# EasyEDA Pro project shangchi.eprj

# Schematic Schematic1
Board Name: Board1; Create Date: 2025-05-25; Page Name: 电源和主控; Project Name: shangchi; Schematic Name: Schematic1; Update Date: 2025-07-31; Company: 嘉立创EDA; Page Size: A4; Version: V1.0
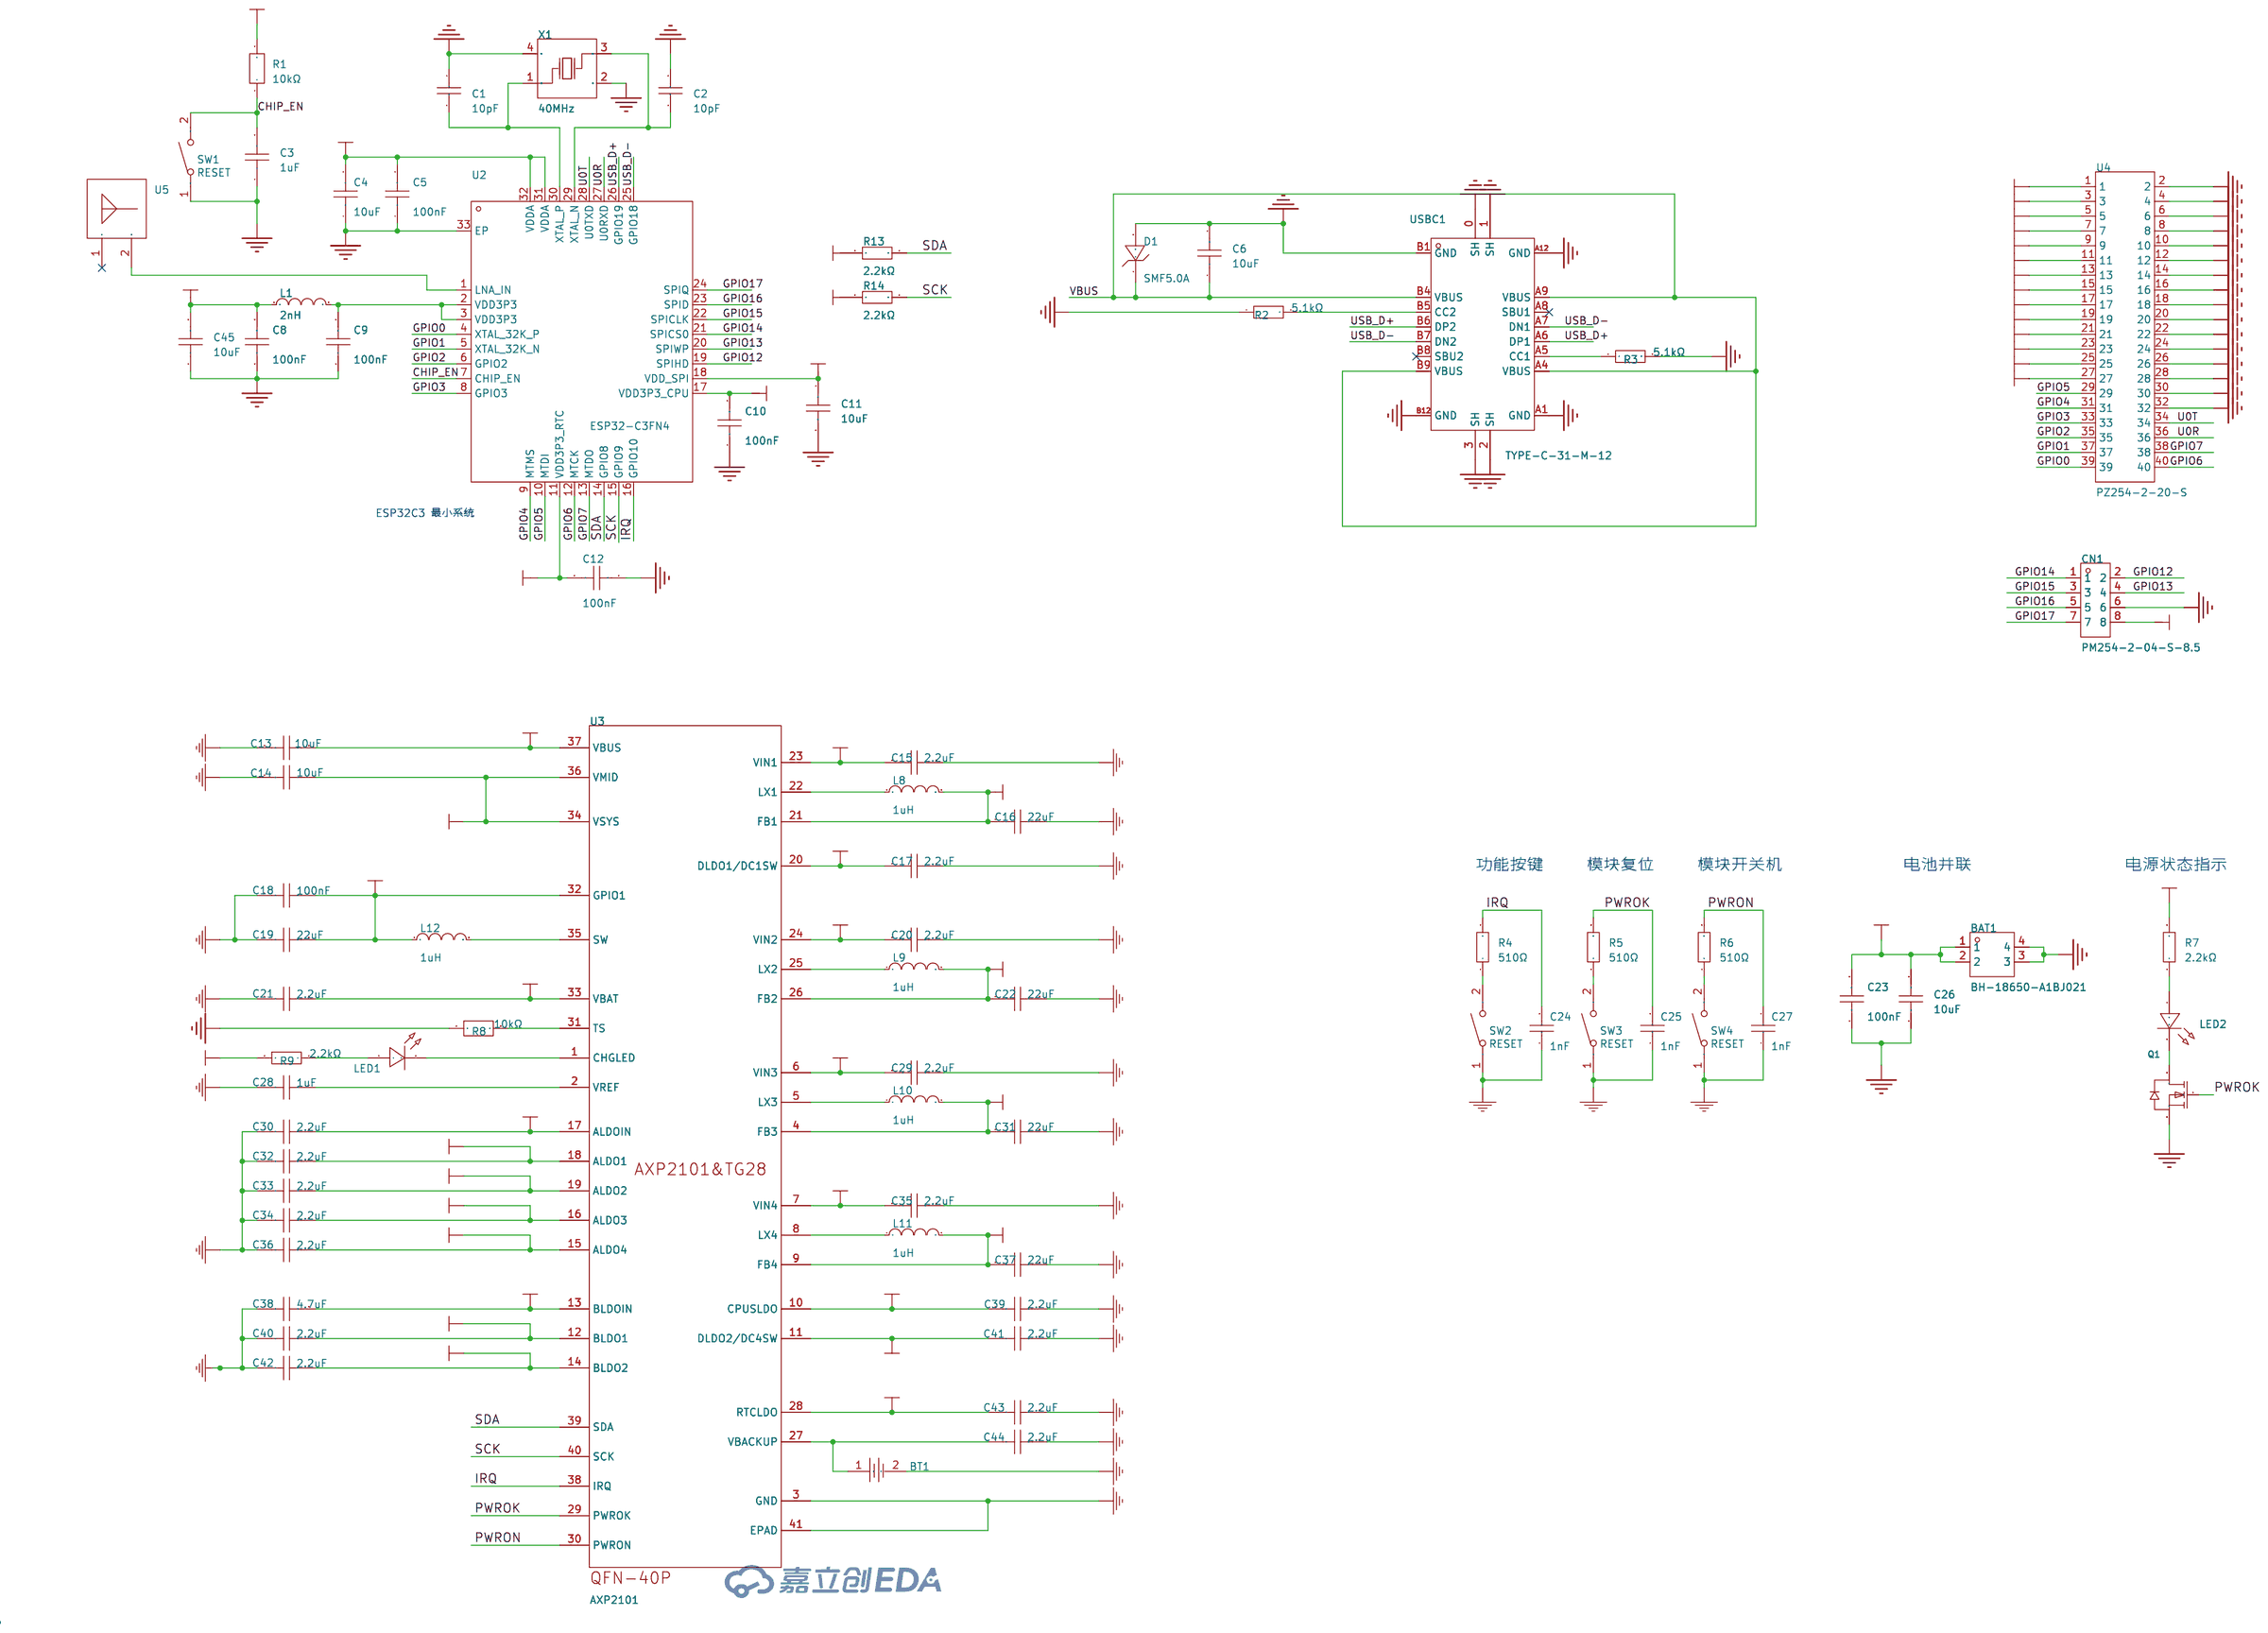
[diagram p0: schematic sheet]

## Parts
BAT1  BH-18650-A1BJ021  [BAT-TH_L77.0-W39.9_BH-18650-A1BJ021]
BT1  CR1220-2ZX  [BAT-SMD_CR1220-2ZX]
C1  10pF  [C0603]
C2  10pF  [C0603]
C3  1uF  [C0603]
C4  10uF  [C0603]
C5  100nF  [C0603]
C6  10uF  [C0603]
C8  100nF  [C0603]
C9  100nF  [C0603]
C10  100nF  [C0603]
C11  10uF  [C0603]
C12  100nF  [C0603]
C13  10uF  [C0603]
C14  10uF  [C0603]
C15  2.2uF  [C0603]
C16  22uF  [C0603]
C17  2.2uF  [C0603]
C18  100nF  [C0603]
C19  22uF  [C0603]
C20  2.2uF  [C0603]
C21  2.2uF  [C0603]
C22  22uF  [C0603]
C23  100nF  [C0603]
C24  1nF  [C0603]
C25  1nF  [C0603]
C26  10uF  [C0603]
C27  1nF  [C0603]
C28  1uF  [C0603]
C29  2.2uF  [C0603]
C30  2.2uF  [C0603]
C31  22uF  [C0603]
C32  2.2uF  [C0603]
C33  2.2uF  [C0603]
C34  2.2uF  [C0603]
C35  2.2uF  [C0603]
C36  2.2uF  [C0603]
C37  22uF  [C0603]
C38  4.7uF  [C0603]
C39  2.2uF  [C0603]
C40  2.2uF  [C0603]
C41  2.2uF  [C0603]
C42  2.2uF  [C0603]
C43  2.2uF  [C0603]
C44  2.2uF  [C0603]
C45  10uF  [C0603]
CN1  PM254-2-04-S-8.5  [HDR-SMD_8P-P2.54-V-F-R2-C4-S7.1]
D1  SMF5.0A  [SOD-123F_L2.8-W1.8-LS3.7-RD]
L1  2nH  [L0603]
L8  1uH  [L0806]
L9  1uH  [L0806]
L10  1uH  [L0806]
L11  1uH  [L0806]
L12  1uH  [L0806]
LED1  SZYY0603R  [LED0603-R-RD]
LED2  SZYY0603R  [LED0603-R-RD]
Q1  AO3400-HXY  [SOT-23_L2.9-W1.3-P1.90-LS2.4-BR]
R1  10kΩ  [R0603]
R2  5.1kΩ  [R0603]
R3  5.1kΩ  [R0603]
R4  510Ω  [R0603]
R5  510Ω  [R0603]
R6  510Ω  [R0603]
R7  2.2kΩ  [R0603]
R8  10kΩ  [R0603]
R9  2.2kΩ  [R0603]
R13  2.2kΩ  [R0603]
R14  2.2kΩ  [R0603]
SW1  RESET  [SW-SMD_L4.0-W2.9-LS5.0]
SW2  RESET  [SW-SMD_L4.0-W2.9-LS5.0]
SW3  RESET  [SW-SMD_L4.0-W2.9-LS5.0]
SW4  RESET  [SW-SMD_L4.0-W2.9-LS5.0]
U2  ESP32-C3FN4  [QFN-32_L5.0-W5.0-P0.50-BL-EP3.7]
U3  AXP2101  [QFN-40_L5.0-W5.0-P0.40-TL-EP3.4]
U4  PZ254-2-20-S  [HDR-SMD_40P-P2.54-V-M-R2-C20-S7.4]
U5  ADWH002  [ANT-SMD_L5.0-W2.0_HM5B]
USBC1  TYPE-C-31-M-12  [USB-C_SMD-TYPE-C-31-M-12]
X1  40MHz  [OSC-SMD_4P-L3.2-W2.5-BL_SIT8008BI]

## Library data of the parts
BAT1 = BH-18650-A1BJ021: LCSC Part Name: 电池盒; Supplier Part: C20606804; Manufacturer: MYOUNG(美阳); Supplier Footprint: 插件; JLCPCB Part Class: 扩展库; Datasheet: https://atta.szlcsc.com/upload/public/pdf/source/20240112/147D77B47FAFC966051AFF7CD950677D.pdf; Supplier: LCSC; Connector Type: 电池盒; Contact Plating: 镍; Operating Temperature Range: -25℃~+85℃
BT1 = CR1220-2ZX: Supplier Part: C969906; Manufacturer: Q&J; Supplier Footprint: SMD; JLCPCB Part Class: Extended Part; Datasheet: https://atta.szlcsc.com/upload/public/pdf/source/20210107/C969906_C1D85B5C66CBBA4D1AEB8467FE1CEC7A.pdf; Supplier: LCSC; Connector Type: 电池底座; Battery Type: CR1220; Operating Temperature Range: -25℃~+85℃
C1 C2 = CL10C100JB8NNNC: LCSC Part Name: 10pF ±5% 50V; Supplier Part: C1634; Manufacturer: SAMSUNG(三星); Supplier Footprint: 0603; JLCPCB Part Class: 基础库; Datasheet: https://atta.szlcsc.com/upload/public/pdf/source/20160218/1457707763339.pdf; Supplier: LCSC; Tolerance: ±5%; Voltage Rated: 50V; Temperature Coefficient: C0G
C3 C28 = CL10A105KO8NNNC: 容值:1uF;精度:±10%;额定电压:16V;材质(温度系数):X5R;; LCSC Part Name: 1uF ±10% 16V; Supplier Part: C1592; Manufacturer: SAMSUNG(三星); Supplier Footprint: 0603; JLCPCB Part Class: Extended Part; Datasheet: https://atta.szlcsc.com/upload/public/pdf/source/20220919/9FBE606BE0D9532D730F292EB26DC5BB.pdf; Supplier: LCSC; Tolerance: ±10%; Voltage Rated: 16V; Temperature Coefficient: X5R
C4 C6 C11 C13 C14 C26 C45 = CL10A106KP8NNNC: 容值:10uF;精度:±10%;额定电压:10V;材质(温度系数):X5R;; LCSC Part Name: 10uF ±10% 10V; Supplier Part: C19702; Manufacturer: SAMSUNG(三星); Supplier Footprint: 0603; JLCPCB Part Class: Basic Part; Datasheet: https://atta.szlcsc.com/upload/public/pdf/source/20160218/1457707763339.pdf; Supplier: LCSC; Tolerance: ±10%; Voltage Rated: 10V; Temperature Coefficient: X5R
C5 C8-C10 C12 C18 C23 = CL10B104KB8NNNC: 容值:100nF;精度:±10%;额定电压:50V;材质(温度系数):X7R;; LCSC Part Name: 100nF ±10% 50V; Supplier Part: C1591; Manufacturer: SAMSUNG(三星); Supplier Footprint: 0603; JLCPCB Part Class: Extended Part; Datasheet: https://atta.szlcsc.com/upload/public/pdf/source/20160218/1457707763339.pdf; Supplier: LCSC; Tolerance: ±10%; Voltage Rated: 50V; Temperature Coefficient: X7R
C15 C17 C20 C21 C29 C30 C32-C36 C39-C44 = CL10A225KP8NNNC: 容值:2.2uF;精度:±10%;额定电压:10V;材质(温度系数):X5R;; LCSC Part Name: 2.2uF ±10% 10V; Supplier Part: C1607; Manufacturer: SAMSUNG(三星); Supplier Footprint: 0603; JLCPCB Part Class: Extended Part; Datasheet: https://atta.szlcsc.com/upload/public/pdf/source/20160218/1457707763339.pdf; Supplier: LCSC; Tolerance: ±10%; Voltage Rated: 10V; Temperature Coefficient: X5R
C16 C19 C22 C31 C37 = CL10A226MQ8NRNC: 容值:22uF;精度:±20%;额定电压:6.3V;材质(温度系数):X5R;; LCSC Part Name: 22uF ±20% 6.3V; Supplier Part: C59461; Manufacturer: SAMSUNG(三星); Supplier Footprint: 0603; JLCPCB Part Class: Basic Part; Datasheet: https://atta.szlcsc.com/upload/public/pdf/source/20160218/1457707763339.pdf; Supplier: LCSC; Tolerance: ±20%; Voltage Rated: 6.3V; Temperature Coefficient: X5R
C24 C25 C27 = CL10B102KB8NNNC: LCSC Part Name: 1nF ±10% 50V; Supplier Part: C1588; Manufacturer: SAMSUNG(三星); Supplier Footprint: 0603; JLCPCB Part Class: 基础库; Datasheet: https://atta.szlcsc.com/upload/public/pdf/source/20160218/1457707763339.pdf; Supplier: LCSC; Tolerance: ±10%; Voltage Rated: 50V; Temperature Coefficient: X7R
C38 = CL10A475KP8NNNC: 容值:4.7uF;精度:±10%;额定电压:10V;材质(温度系数):X5R;; LCSC Part Name: 4.7uF ±10% 10V; Supplier Part: C1705; Manufacturer: SAMSUNG(三星); Supplier Footprint: 0603; JLCPCB Part Class: Extended Part; Datasheet: https://atta.szlcsc.com/upload/public/pdf/source/20160218/1457707763339.pdf; Supplier: LCSC; Tolerance: ±10%; Voltage Rated: 10V; Temperature Coefficient: X5R
CN1 = PM254-2-04-S-8.5: LCSC Part Name: 2x4P 间距:2.54mm 立贴; Supplier Part: C3975149; Manufacturer: HCTL(华灿天禄); Supplier Footprint: SMD,P=2.54mm; JLCPCB Part Class: 扩展库; Datasheet: https://atta.szlcsc.com/upload/public/pdf/source/20230609/7C6F8D8E301C6BBC8F19D55951C36597.pdf; Supplier: LCSC; Holes Structure: 2x4P; Pitch: 2.54mm; Row Spacing: 2.54mm; Circular Hole / Square Hole: 方孔; Mounting Type: 立贴; Number of Rows: 双排; Number of Holes: 8P; Current Rating (Max): 3A; Holes Direction: 顶部; Insulation Height: 8.5mm; Contact Material: 铜合金; Operating Temperature Range: -40℃~+105℃; Soldering Temperature(Max): 260℃@5S
D1 = SMF5.0A_C151296: Supplier Part: C151296; Manufacturer: Littelfuse(美国力特); Supplier Footprint: SOD-123; JLCPCB Part Class: 扩展库; Datasheet: https://atta.szlcsc.com/upload/public/pdf/source/20171201/C151298_15121179413071156555.pdf; Supplier: LCSC; Reverse Stand-Off Voltage (Vrwm): 5V; Maximum Clamping Voltage: 9.2V; Peak Pulse Current (Ipp)@10/1000us: 21.7A; Peak Pulse Power Dissipation (Ppp)@10/1000us: 200W; Breakdown Voltage: 6.4V; Type: TVS
L1 = L_0402: Supplier Footprint: L0402
L8-L12 = HEI201610K-1R0M-Q8DG: LCSC Part Name: 1uH ±20%; Supplier Part: C329576; Manufacturer: Chilisin(奇力新); Supplier Footprint: 0806; JLCPCB Part Class: 扩展库; Datasheet: https://atta.szlcsc.com/upload/public/pdf/source/20190910/C329576_D50CD53D5578B4F4024C555ED7112D00.pdf; Supplier: LCSC; Tolerance: ±20%; Current Rating: 3.1A; DC Resistance(DCR): 50mΩ
LED1 LED2 = SZYY0603R: LCSC Part Name: 红灯; Supplier Part: C434419; Manufacturer: yongyu(永裕光电); Supplier Footprint: 0603; JLCPCB Part Class: Extended Part; Datasheet: https://atta.szlcsc.com/upload/public/pdf/source/20191204/C434419_0B955C1F73FF88449D9A795B6FF49070.pdf; Supplier: LCSC; Emitted Color: 红色; Power Dissipation: 40mW; Forward Current: 20mA; Dominant Wavelength: 615nm~630nm; Peak Wavelength: 645nm; Lens Color: 无色透明透镜; Viewing Angle: 120°; Operating Temperature: -40℃~+85℃
Q1 = AO3400-HXY: 类型:N沟道;漏源电压(Vdss):30V;连续漏极电流(Id):5.8A;功率(Pd):1.4W;导通电阻(RDS(on)@Vgs,Id):28mΩ@10V,5.8A;; LCSC Part Name: N沟道 30V 5.8A; Supplier Part: C4748804; Manufacturer: HXY MOSFET(华轩阳电子); Supplier Footprint: SOT-23; Datasheet: https://atta.szlcsc.com/upload/public/pdf/source/20221216/C6CAAE960F4F5F0616BD2E5413E1C3AD.pdf; Supplier: LCSC; Type: N沟道; Drain Source Voltage (Vdss): 30V; Continuous Drain Current (Id): 5.8A; Power Dissipation (Pd): 1.4W; Drain Source On Resistance (RDS(on)@Vgs,Id): 28mΩ@10V,5.8A; Gate Threshold Voltage (Vgs(th)@Id): 1.4V@250uA; Input Capacitance (Ciss@Vds): 825pF@15V
R1 R8 = RC1608F103CS: LCSC Part Name: 厚膜电阻 10kΩ ±1% 100mW; Supplier Part: C17441167; Manufacturer: SAMSUNG(三星); Supplier Footprint: 0603; JLCPCB Part Class: 扩展库; Datasheet: https://atta.szlcsc.com/upload/public/pdf/source/20210602/455D0E07AED06E76D0C921B8CB06E528.pdf; Supplier: LCSC; Type: 厚膜电阻; Tolerance: ±1%; Power(Watts): 100mW; Temperature Coefficient: ±100ppm/℃; Operating Temperature Range: -55℃~+155℃
R2 R3 = 0603WAF5101T5E: LCSC Part Name: 5.1kΩ ±1% 100mW 厚膜电阻; Supplier Part: C23186; Manufacturer: UNI-ROYAL(厚声); Supplier Footprint: 0603; JLCPCB Part Class: 基础库; Datasheet: https://atta.szlcsc.com/upload/public/pdf/source/20200306/C422600_1E6D84923E4A46A82E41ADD87F860B5C.pdf; Supplier: LCSC; Type: 厚膜电阻; Tolerance: ±1%; Power(Watts): 100mW; Overload Voltage (Max): 75V; Temperature Coefficient: ±100ppm/℃; Operating Temperature Range: -55℃~+155℃
R4-R6 = 0603WAF5100T5E: LCSC Part Name: 510Ω ±1% 100mW 厚膜电阻; Supplier Part: C23193; Manufacturer: UNI-ROYAL(厚声); Supplier Footprint: 0603; JLCPCB Part Class: 基础库; Datasheet: https://atta.szlcsc.com/upload/public/pdf/source/20200306/C422600_1E6D84923E4A46A82E41ADD87F860B5C.pdf; Supplier: LCSC; Type: 厚膜电阻; Tolerance: ±1%; Power(Watts): 100mW; Overload Voltage (Max): 75V; Temperature Coefficient: ±100ppm/℃; Operating Temperature Range: -55℃~+155℃
R7 R9 R13 R14 = 0603WAF2201T5E: LCSC Part Name: 2.2kΩ ±1% 100mW 厚膜电阻; Supplier Part: C4190; Manufacturer: UNI-ROYAL(厚声); Supplier Footprint: 0603; JLCPCB Part Class: 基础库; Datasheet: https://atta.szlcsc.com/upload/public/pdf/source/20200306/C422600_1E6D84923E4A46A82E41ADD87F860B5C.pdf; Supplier: LCSC; Type: 厚膜电阻; Tolerance: ±1%; Power(Watts): 100mW; Overload Voltage (Max): 75V; Temperature Coefficient: ±100ppm/℃; Operating Temperature Range: -55℃~+155℃
SW1-SW4 = RESET: Supplier: LCSC; Supplier Part: C318893; Manufacturer: XKB Enterprise; Manufacturer Part: TS-1185EC-C-D-B; JLCPCB Part Class: Extended Part
U2 = ESP32-C3FN4: LCSC Part Name: 搭载 RISC-V 32 位单核处理器的极低功耗 SoC; Supplier Part: C2848860; Manufacturer: ESPRESSIF(乐鑫); Supplier Footprint: QFN-32-EP(5x5); JLCPCB Part Class: 扩展库; Datasheet: https://atta.szlcsc.com/upload/public/pdf/source/20240822/B2742F38BA1EE0E2910459276C4BCB53.pdf; Supplier: LCSC
U3 = AXP2101: A PMU designed by Allwinner; Supplier Part: C3036461; Manufacturer: x-powers; Supplier Footprint: QFN-40-EP(5x5); JLCPCB Part Class: Extended Part; Datasheet: https://atta.szlcsc.com/upload/public/pdf/source/20230506/27D868F447993329A9E953603DF31964.pdf; Supplier: LCSC
U4 = PZ254-2-20-S: LCSC Part Name: 黑色 2x20P 间距:2.54mm 方针 立贴; Supplier Part: C3294478; Manufacturer: HCTL(华灿天禄); Supplier Footprint: SMD,P=2.54mm; JLCPCB Part Class: 扩展库; Datasheet: https://atta.szlcsc.com/upload/public/pdf/source/20230609/FB2B5B924AA338E6CB93C3BD1D012B72.pdf; Supplier: LCSC; Pin Structure: 2x20P; Pitch: 2.54mm; Row Spacing: 2.54mm; Circluar Pins/Square Pins: 方针; Mounting Type: 立贴; Number of Rows: 双排; Number of Pins: 40P; Current Rating: 3A; Voltage Rating (Max): 250V; Length of Mating Pin: 6mm; Insulation Height: 2.5mm; Operating Temperature: -40℃~+105℃; Color: 黑色
U5 = ADWH002: LCSC Part Name: 2.4GHz SMD贴片天线 蓝牙/WiFi/zigbee芯片天线 大款; Supplier Part: C22467691; Manufacturer: MyAntenna(摩天射频); Supplier Footprint: SMD; JLCPCB Part Class: 扩展库; Datasheet: https://atta.szlcsc.com/upload/public/pdf/source/20240625/D215ED83B6453DB4ED1D0491E177A9EC.pdf; Supplier: LCSC; Frequency(Center/Band): 2.45GHz; Bandwidth: 100MHz; Peak Gain: 0.67dBi; Impedance: 50Ω; Power: 3W; VSWR: 2; Operating Temperature: -40℃~+85℃
USBC1 = TYPE-C-31-M-12: LCSC Part Name: Type-C 母; Supplier Part: C165948; Manufacturer: 韩国韩荣; Supplier Footprint: SMD; JLCPCB Part Class: Extended Part; Datasheet: https://atta.szlcsc.com/upload/public/pdf/source/20220525/466408E853115E789EDB0DDC29077C05.pdf; Supplier: LCSC; Connector Type: Type-C; Gender: 母; Number of Contacts: 16P; Number of Ports: 1; Current Rating - Power (Max): 5A
X1 = X322540MPB4SI: 频率:40MHz;频率公差:±10ppm;负载电容:15pF;; LCSC Part Name: 40MHz ±10ppm 15pF YSX321SL; Supplier Part: C9010; Manufacturer: YXC(扬兴晶振); Supplier Footprint: SMD3225-4P; JLCPCB Part Class: 扩展库; Datasheet: https://atta.szlcsc.com/upload/public/pdf/source/20210329/C112971_1F611BDC486E193C1706F6D8EB5AA189.pdf; Supplier: LCSC; Crystal Type: 贴片无源晶振; Frequency Tolerance: ±10ppm; Frequency Stability: ±30ppm; Load Capacitance: 15pF; Operating Temperature: -40℃~+85℃

## Nets
3V3: C4.2 C5.2 C8.2 C10.2 C11.1 C12.2 C16.1 C45.2 CN1.8 L1.1 L8.2 R1.2 R13.2 R14.2 U2.11(VDD3P3_RTC) U2.17(VDD3P3_CPU) U2.18(VDD_SPI) U2.31(VDDA) U2.32(VDDA) U3.21(FB1)
GND: BAT1.3 BAT1.4 BT1.2 C1.2 C2.2 C3.1 C4.1 C5.1 C6.2 C8.1 C9.1 C10.1 C11.2 C12.1 C13.1 C14.2 C15.2 C16.2 C17.2 C18.1 C19.1 C20.2 C21.1 C22.2 C23.1 C24.1 C25.1 C26.1 C27.1 C28.1 C29.2 C30.1 C31.2 C32.1 C33.1 C34.1 C35.2 C36.1 C37.2 C38.1 C39.2 C40.1 C41.2 C42.1 C43.2 C44.2 C45.1 CN1.6 D1.2 Q1.2(S) R2.1 R3.2 R8.1 SW1.1 SW2.1 SW3.1 SW4.1 U2.33(EP) U3.3(GND) U3.41(EPAD) U4.2 U4.4 U4.6 U4.8 U4.10 U4.12 U4.14 U4.16 U4.18 U4.20 U4.22 U4.24 U4.26 U4.28 U4.30 U4.32 USBC1.0(SH) USBC1.1(SH) USBC1.2(SH) USBC1.3(SH) USBC1.A1(GND) USBC1.A12(GND) USBC1.B1(GND) USBC1.B12(GND) X1.2(GND) X1.4(GND)
VBAT: BAT1.1 BAT1.2 C21.2 C23.2 C26.2 U3.33(VBAT)
VBUS: C6.1 C13.2 D1.1 U3.37(VBUS) USBC1.A4(VBUS) USBC1.A9(VBUS) USBC1.B4(VBUS) USBC1.B9(VBUS)
ALDO1: C32.2 U3.18(ALDO1) U4.13
ALDO2: C33.2 U3.19(ALDO2) U4.11
ALDO3: C34.2 U3.16(ALDO3) U4.15
ALDO4: C36.2 U3.15(ALDO4) U4.17
BLDO1: C40.2 U3.12(BLDO1) U4.21
BLDO2: C42.2 U3.14(BLDO2) U4.19
CHIP_EN: C3.2 R1.1 SW1.2 U2.7(CHIP_EN)
CPUS_LDO: C39.1 U3.10(CPUSLDO) U4.25
DC1SW: C17.1 U3.20(DLDO1/DC1SW) U4.9
DC4SW: C41.1 U3.11(DLDO2/DC4SW) U4.23
DCDC2: C22.1 L9.2 U3.26(FB2) U4.7
DCDC3: C31.1 L10.2 U3.4(FB3) U4.1
DCDC4: C37.1 L11.2 U3.9(FB4) U4.27
DCDC5: C18.2 C19.2 L12.1 U3.32(GPIO1) U4.3
GPIO0: U2.4(XTAL_32K_P) U4.39
GPIO1: U2.5(XTAL_32K_N) U4.37
GPIO2: U2.6(GPIO2) U4.35
GPIO3: U2.8(GPIO3) U4.33
GPIO4: U2.9(MTMS) U4.31
GPIO5: U2.10(MTDI) U4.29
GPIO6: U2.12(MTCK) U4.40
GPIO7: U2.13(MTDO) U4.38
GPIO12: CN1.2 U2.19(SPIHD)
GPIO13: CN1.4 U2.20(SPIWP)
GPIO14: CN1.1 U2.21(SPICS0)
GPIO15: CN1.3 U2.22(SPICLK)
GPIO16: CN1.5 U2.23(SPID)
GPIO17: CN1.7 U2.24(SPIQ)
IRQ: C24.2 R4.2 U2.16(GPIO10) U3.38(IRQ)
PWROK: C25.2 Q1.1(G) R5.2 U3.29(PWROK)
PWRON: C27.2 R6.2 U3.30(PWRON)
RTC_LDO: C43.1 U3.28(RTCLDO) U4.5
SCK: R14.1 U2.15(GPIO9) U3.40(SCK)
SDA: R13.1 U2.14(GPIO8) U3.39(SDA)
U0R: U2.27(U0RXD) U4.36
U0T: U2.28(U0TXD) U4.34
USB_D+: U2.26(GPIO19) USBC1.A6(DP1) USBC1.B6(DP2)
USB_D-: U2.25(GPIO18) USBC1.A7(DN1) USBC1.B7(DN2)
VSYS: C14.1 C15.1 C20.1 C29.1 C30.2 C35.1 C38.2 R7.2 R9.2 U3.6(VIN3) U3.7(VIN4) U3.13(BLDOIN) U3.17(ALDOIN) U3.23(VIN1) U3.24(VIN2) U3.34(VSYS) U3.36(VMID)
$1N8836: L8.1 U3.22(LX1)
$1N8845: L9.1 U3.25(LX2)
$1N8850: L10.1 U3.5(LX3)
$1N8855: L11.1 U3.8(LX4)
$1N8862: BT1.1 C44.1 U3.27(VBACKUP)
$1N8871: R8.2 U3.31(TS)
$1N8873: LED1.2 U3.1(CHGLED)
$1N8896: L12.2 U3.35(SW)
$1N8898: C28.2 U3.2(VREF)
$1N13051: R5.1 SW3.2
$1N13052: R6.1 SW4.2
$1N13056: R4.1 SW2.2
$1N13125: LED1.1 R9.1
$1N13254: LED2.2 Q1.3(D)
$1N13255: LED2.1 R7.1
$1N17315: C1.1 U2.30(XTAL_P) X1.1(OSC1)
$1N17316: C2.1 U2.29(XTAL_N) X1.3(OSC2)
$1N17339: C9.2 L1.2 U2.2(VDD3P3) U2.3(VDD3P3)
$1N23040: R3.1 USBC1.A5(CC1)
$1N23042: R2.2 USBC1.B5(CC2)
$1N41990: U2.1(LNA_IN) U5.2(GND)

Not connected (* = marked no-connect by the designer): U5 1(IN)*; USBC1 A8(SBU1)* B8(SBU2)*

## Notes on the sheet
- ESP32C3 最小系统
- 功能按键
- 模块复位
- 模块开关机
- 电池并联
- 电源状态指示

# Board PCB1
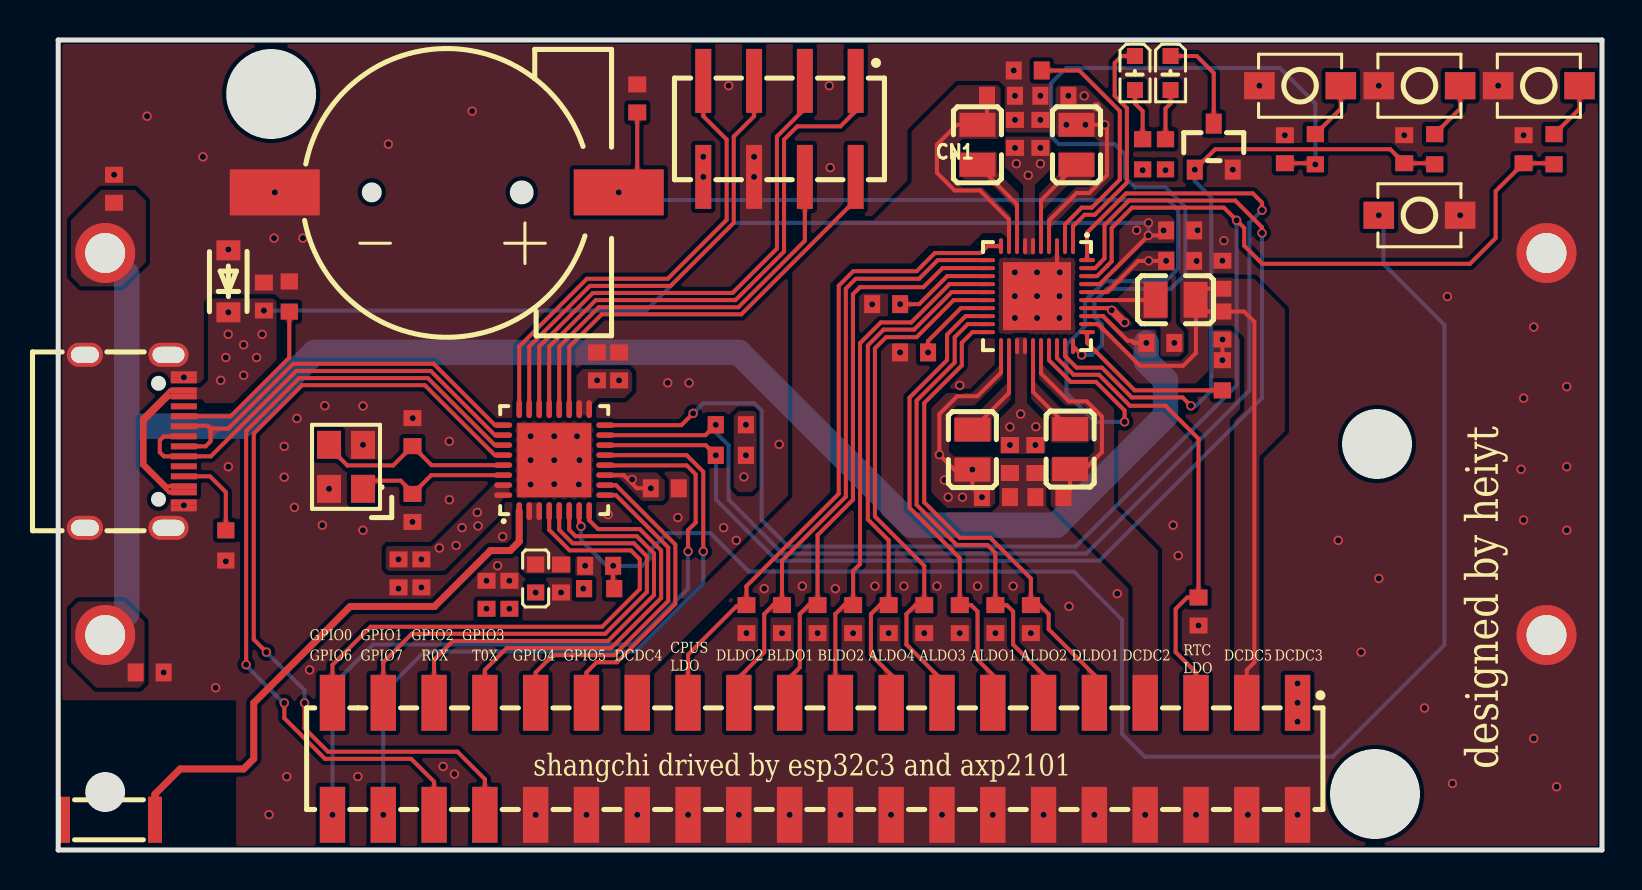
[diagram p1: board, top side]
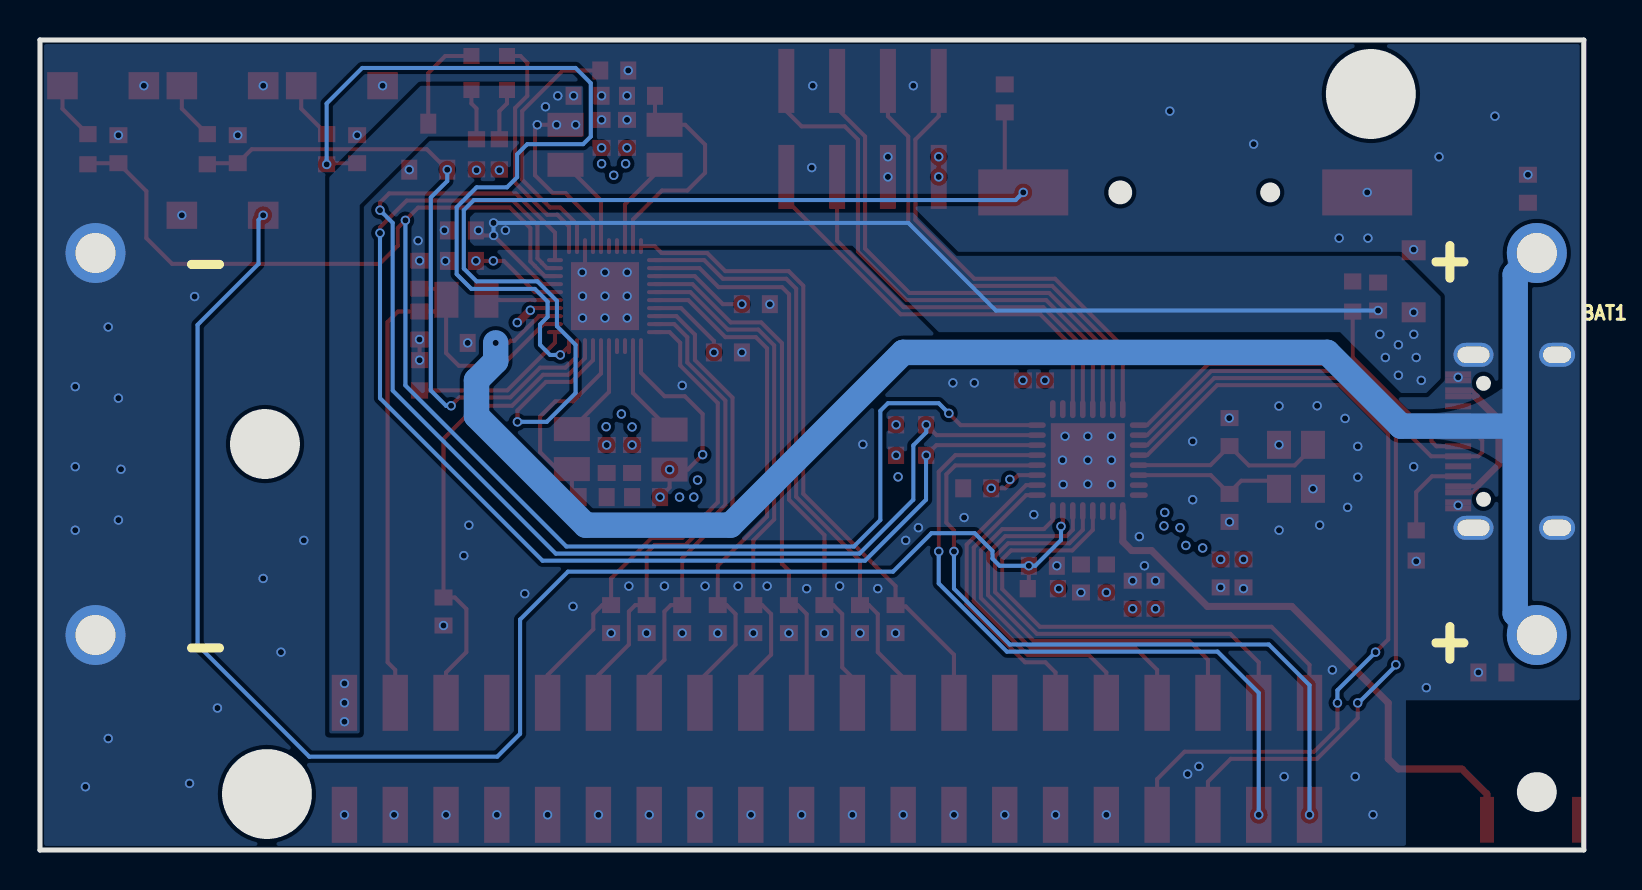
[diagram p2: board, bottom side, seen from below]

Outline 77.2 x 40.5 mm; copper layers: Top Layer, Inner1, Inner2, Bottom Layer. Coordinates in mm from the lower left corner of the outline.
Outline path: 0,40.5 0,0 77.2,0 77.2,40.5 0,40.5
Stack: Top Layer 0.035mm 外层铜厚1oz / Dielectric1 0.2104mm 7628 RC49% 8.6mil / Inner1 0.0152mm 内层铜厚 / Dielectric2 1.065mm 1.1mm H/HOZ Copper / Inner2 0.0152mm 内层铜厚 / Dielectric3 0.2104mm 7628 RC49% 8.6mil / Bottom Layer 0.035mm 外层铜厚1oz

## Design rules (mm)
template: 自定义配置
spacing copperThickness1oz (default): track to track 0.152, other pairs 0.152 to 0.3
spacing copperThickness2oz: track to track 0.203, other pairs 0.152 to 0.3
track width copperThickness1oz (default): min 0.127, default 0.203, max 2.54
track width copperThickness2oz: min 0.203, default 0.254, max 2.54
differential pair differentialPair (default): width min 0.127, default 0.254, max 2.54; gap min 0.152, default 0.152
via viaSize (default): diameter min 0.47, default 0.47, max 10; hole min 0.3, default 0.305, max 6.299

## Placement (name value [footprint] x y rotation side)
BAT1  BH-18650-A1BJ021  [BAT-TH_L77.0-W39.9_BH-18650-A1BJ021]  38.39 20.3 0 bottom
BT1  CR1220-2ZX  [BAT-SMD_CR1220-2ZX]  19.43 32.88 180 top
C1  10pF  [C0603]  17.72 17.1 270 top
C2  10pF  [C0603]  17.72 20.89 90 top
C3  1uF  [C0603]  27.05 14.21 0 top
C4  10uF  [C0603]  18.16 13.83 90 top
C5  100nF  [C0603]  17.02 13.83 90 top
C6  10uF  [C0603]  10.29 27.67 90 top
C8  100nF  [C0603]  22.56 12.76 270 top
C9  100nF  [C0603]  25.15 13.58 90 top
C10  100nF  [C0603]  26.94 24.18 270 top
C11  10uF  [C0603]  28.05 24.18 90 top
C12  100nF  [C0603]  30.33 18.08 180 top
C13  10uF  [C0603]  56.1 30.98 180 top
C14  10uF  [C0603]  56.1 29.46 0 top
C15  2.2uF  [C0603]  47.59 19.55 270 top
C16  22uF  [C0603]  46.89 17.64 0 top
C17  2.2uF  [C0603]  48.64 11.54 270 top
C18  100nF  [C0603]  58.22 26.22 90 top
C19  22uF  [C0603]  58.22 28.76 270 top
C20  2.2uF  [C0603]  48.86 19.55 270 top
C21  2.2uF  [C0603]  55.11 25.36 180 top
C22  22uF  [C0603]  49.56 17.64 180 top
C23  100nF  [C0603]  2.79 33.06 270 top
C24  1nF  [C0603]  73.28 35.04 270 top
C25  1nF  [C0603]  67.31 35.04 270 top
C26  10uF  [C0603]  4.57 8.88 180 top
C27  1nF  [C0603]  61.34 35.04 270 top
C28  1uF  [C0603]  48.48 38.98 0 top
C29  2.2uF  [C0603]  49.12 35.81 90 top
C30  2.2uF  [C0603]  42.8 24.88 0 top
C31  22uF  [C0603]  49.82 37.71 180 top
C32  2.2uF  [C0603]  45.09 11.54 90 top
C33  2.2uF  [C0603]  46.86 11.54 90 top
C34  2.2uF  [C0603]  43.31 11.54 90 top
C35  2.2uF  [C0603]  47.85 35.81 90 top
C36  2.2uF  [C0603]  41.53 11.54 90 top
C37  22uF  [C0603]  47.15 37.71 0 top
C38  4.7uF  [C0603]  41.4 27.29 0 top
C39  2.2uF  [C0603]  34.42 11.54 270 top
C40  2.2uF  [C0603]  37.97 11.54 90 top
C41  2.2uF  [C0603]  36.19 11.54 270 top
C42  2.2uF  [C0603]  39.75 11.54 90 top
C43  2.2uF  [C0603]  57.02 11.92 270 top
C44  2.2uF  [C0603]  28.96 37.58 90 top
C45  10uF  [C0603]  21.42 12.76 270 top
CN1  PM254-2-04-S-8.5  [HDR-SMD_8P-P2.54-V-F-R2-C4-S7.1]  36.07 36.06 180 top
D1  SMF5.0A  [SOD-123F_L2.8-W1.8-LS3.7-RD]  8.51 28.44 90 top
L1  2nH  [L0603]  23.88 13.58 90 top
L8  1uH  [L0806]  45.72 20.02 270 top
L9  1uH  [L0806]  50.6 20.05 270 top
L10  1uH  [L0806]  50.92 35.26 90 top
L11  1uH  [L0806]  45.97 35.26 90 top
L12  1uH  [L0806]  55.88 27.51 180 top
LED1  SZYY0603R  [LED0603-R-RD]  53.85 38.85 270 top
LED2  SZYY0603R  [LED0603-R-RD]  55.63 38.85 270 top
Q1  AO3400-HXY  [SOT-23_L2.9-W1.3-P1.90-LS2.4-BR]  57.78 35.17 270 top
R1  10kΩ  [R0603]  27.05 13.07 180 top
R2  5.1kΩ  [R0603]  8.38 15.23 90 top
R3  5.1kΩ  [R0603]  11.56 27.67 90 top
R4  510Ω  [R0603]  74.8 35.04 270 top
R5  510Ω  [R0603]  68.83 35.04 270 top
R6  510Ω  [R0603]  62.87 35.04 270 top
R7  2.2kΩ  [R0603]  55.37 34.78 270 top
R8  10kΩ  [R0603]  58.22 23.74 270 top
R9  2.2kΩ  [R0603]  54.23 34.78 270 top
R13  2.2kΩ  [R0603]  33.64 19.74 0 top
R14  2.2kΩ  [R0603]  33.64 21.26 0 top
SW1  RESET  [SW-SMD_L4.0-W2.9-LS5.0]  68.07 31.74 180 top
SW2  RESET  [SW-SMD_L4.0-W2.9-LS5.0]  74.04 38.21 0 top
SW3  RESET  [SW-SMD_L4.0-W2.9-LS5.0]  68.07 38.21 0 top
SW4  RESET  [SW-SMD_L4.0-W2.9-LS5.0]  62.1 38.21 0 top
U2  ESP32-C3FN4  [QFN-32_L5.0-W5.0-P0.50-BL-EP3.7]  24.8 19.49 0 top
U3  AXP2101  [QFN-40_L5.0-W5.0-P0.40-TL-EP3.4]  48.95 27.69 270 top
U4  PZ254-2-20-S  [HDR-SMD_40P-P2.54-V-M-R2-C20-S7.4]  37.85 4.56 180 top
U5  ADWH002  [ANT-SMD_L5.0-W2.0_HM5B]  2.54 1.51 0 top
USBC1  TYPE-C-31-M-12  [USB-C_SMD-TYPE-C-31-M-12]  3.81 20.43 270 top
X1  40MHz  [OSC-SMD_4P-L3.2-W2.5-BL_SIT8008BI]  14.39 19.16 90 top

## Footprints (pads in the part's own frame, mm; a bottom-side part is the same pattern mirrored in y, then rotated)
ANT-SMD_L5.0-W2.0_HM5B
  rect 0.7x2.3 smd: 1(-2.3,0) 2(2.3,0)
BAT-SMD_CR1220-2ZX
  rect 4.5x2.3 smd: 1(-8.6,0) 2(8.6,0)
BAT-TH_L77.0-W39.9_BH-18650-A1BJ021
  round 3 hole 2: 1(-36.038,9.55) 2(-36.038,-9.55) 3(36.038,-9.55) 4(36.038,9.55)
C0603
  rect 0.8x0.9 smd: 1(-0.7,0) 2(0.7,0)
HDR-SMD_8P-P2.54-V-F-R2-C4-S7.1
  rect 0.8x3.2 smd: 1(-3.81,-2.4) 2(-3.81,2.4) 3(-1.27,-2.4) 4(-1.27,2.4) 5(1.27,-2.4) 6(1.27,2.4) 7(3.81,-2.4) 8(3.81,2.4)
HDR-SMD_40P-P2.54-V-M-R2-C20-S7.4
  rect 1.27x2.8 smd: 1(-24.13,-2.8) 2(-24.13,2.8) 3(-21.59,-2.8) 4(-21.59,2.8) 5(-19.05,-2.8) 6(-19.05,2.8) 7(-16.51,-2.8) 8(-16.51,2.8) 9(-13.97,-2.8) 10(-13.97,2.8) 11(-11.43,-2.8) 12(-11.43,2.8) 13(-8.89,-2.8) 14(-8.89,2.8) 15(-6.35,-2.8) 16(-6.35,2.8) 17(-3.81,-2.8) 18(-3.81,2.8) 19(-1.27,-2.8) 20(-1.27,2.8) 21(1.27,-2.8) 22(1.27,2.8) 23(3.81,-2.8) 24(3.81,2.8) 25(6.35,-2.8) 26(6.35,2.8) 27(8.89,-2.8) 28(8.89,2.8) 29(11.43,-2.8) 30(11.43,2.8) 31(13.97,-2.8) 32(13.97,2.8) 33(16.51,-2.8) 34(16.51,2.8) 35(19.05,-2.8) 36(19.05,2.8) 37(21.59,-2.8) 38(21.59,2.8) 39(24.13,-2.8) 40(24.13,2.8)
L0603
  rect 0.8x0.864 smd: 1(-0.7,0) 2(0.7,0)
L0806
  rect 1.2x1.8 smd: 1(-1,0) 2(1,0)
LED0603-R-RD
  rect 0.8x0.8 smd: 1(0.851,0) 2(-0.851,0)
OSC-SMD_4P-L3.2-W2.5-BL_SIT8008BI
  rect 1.4x1.2 smd: 1(-1.1,-0.85) 2(1.1,-0.85) 3(1.1,0.85) 4(-1.1,0.85)
QFN-32_L5.0-W5.0-P0.50-BL-EP3.7
  oval 0.28x0.9 smd: 1(-1.75,-2.55) 2(-1.25,-2.55) 3(-0.75,-2.55) 4(-0.25,-2.55) 5(0.25,-2.55) 6(0.75,-2.55) 7(1.25,-2.55) 8(1.75,-2.55) 17(1.75,2.55) 18(1.25,2.55) 19(0.75,2.55) 20(0.25,2.55) 21(-0.25,2.55) 22(-0.75,2.55) 23(-1.25,2.55) 24(-1.75,2.55)
  oval 0.9x0.28 smd: 9(2.55,-1.75) 10(2.55,-1.25) 11(2.55,-0.75) 12(2.55,-0.25) 13(2.55,0.25) 14(2.55,0.75) 15(2.55,1.25) 16(2.55,1.75) 25(-2.55,1.75) 26(-2.55,1.25) 27(-2.55,0.75) 28(-2.55,0.25) 29(-2.55,-0.25) 30(-2.55,-0.75) 31(-2.55,-1.25) 32(-2.55,-1.75)
  rect 3.7x3.7 smd: 33(0,0)
QFN-40_L5.0-W5.0-P0.40-TL-EP3.4
  oval 0.8x0.2 smd: 1(-2.5,1.8) 2(-2.5,1.4) 3(-2.5,1) 4(-2.5,0.6) 5(-2.5,0.2) 6(-2.5,-0.2) 7(-2.5,-0.6) 8(-2.5,-1) 9(-2.5,-1.4) 10(-2.5,-1.8) 21(2.5,-1.8) 22(2.5,-1.4) 23(2.5,-1) 24(2.5,-0.6) 25(2.5,-0.2) 26(2.5,0.2) 27(2.5,0.6) 28(2.5,1) 29(2.5,1.4) 30(2.5,1.8)
  oval 0.2x0.8 smd: 11(-1.8,-2.5) 12(-1.4,-2.5) 13(-1,-2.5) 14(-0.6,-2.5) 15(-0.2,-2.5) 16(0.2,-2.5) 17(0.6,-2.5) 18(1,-2.5) 19(1.4,-2.5) 20(1.8,-2.5) 31(1.8,2.5) 32(1.4,2.5) 33(1,2.5) 34(0.6,2.5) 35(0.2,2.5) 36(-0.2,2.5) 37(-0.6,2.5) 38(-1,2.5) 39(-1.4,2.5) 40(-1.8,2.5)
  rect 3.4x3.4 smd: 41(0,0)
R0603
  rect 0.806x0.864 smd: 1(-0.753,0) 2(0.753,0)
SOD-123F_L2.8-W1.8-LS3.7-RD
  rect 1x1.2 smd: 1(-1.55,0) 2(1.55,0)
SOT-23_L2.9-W1.3-P1.90-LS2.4-BR
  rect 1x0.8 smd: 1(1.15,-0.95) 2(1.15,0.95) 3(-1.15,0)
SW-SMD_L4.0-W2.9-LS5.0
  rect 1.53x1.36 smd: 1(-2.035,0) 2(2.035,0)
USB-C_SMD-TYPE-C-31-M-12
  oval 1.2x2 hole 0.8x1.6: 0(-4.325,1.706) 1(4.325,1.706)
  oval 1.2x1.8 hole 0.8x1.4: 2(4.325,-2.474) 3(-4.325,-2.474)
  rect 0.3x1.3 smd: A1(-3.35,2.474) A4(-2.55,2.474) A5(-1.25,2.474) A6(-0.25,2.474) A7(0.25,2.474) A8(1.25,2.474) A9(2.55,2.474) A12(3.35,2.474) B1(3.05,2.474) B4(2.25,2.474) B5(1.75,2.474) B6(0.75,2.474) B7(-0.75,2.474) B8(-1.75,2.474) B9(-2.25,2.474) B12(-3.05,2.474)

## Nets
As in the schematic.

Pads without a net: U5 1; USBC1 A8 B8

## Via types
v1: diameter 0.47, hole 0.305, Top Layer to Bottom Layer, 239 vias

## Routing (per net, layer and track width the routed paths; a pad name or vN(x,y) marks a point on that pad's centre or on a via; arc(x,y) is an arc through that point)
3V3: length 13.3
  Top Layer w0.203: 29.57,18.08 28.94,18.08 28.28,18.74 U2.11 ; U3.21 47.15,23.87 45.97,22.69 44.95,22.69 44.06,21.8 v1(44.06,19.77) 44.81,19.02 v1(45.72,19.02) 45.72,18.12 v1(46.19,17.64)
  vias: v1(17.02,14.53) v1(18.16,14.53) v1(19.06,15.1) v1(19.9,15.23) v1(20.19,16.12) v1(20.96,16.88) v1(20.99,16.2) v1(21.42,12.06) v1(22.56,12.06) v1(23.88,12.88) v1(26.26,13.07) v1(26.95,23.48) v1(28.05,23.48) v1(28.7,18.53) v1(29.63,18.08) v1(32.26,34.66) v1(32.26,33.66) v1(34.29,18.66) v1(34.39,21.26) v1(34.39,19.74) v1(44.32,18.5) v1(44.51,17.64) v1(45.22,17.64)
GND: length 3.9
  Top Layer w0.203: U3.3 49.95,28.69 v1(48.95,27.69) ; C18.1 v1(58.22,24.49)
  vias: v1(2.79,33.76) v1(4.44,36.69) v1(5.27,8.88) v1(6.28,23.63) v1(6.28,17.23) v1(7.24,34.66) v1(7.87,8.11) v1(8.38,14.43) v1(8.51,30.02) v1(8.51,19.16) v1(10.54,1.77) v1(10.83,32.88) v1(10.8,30.59) v1(11.3,20.18) v1(11.3,18.64) v1(11.43,3.67) v1(11.81,17.13) v1(11.94,21.58) v1(12.24,30.59) v1(12.57,9) v1(13.21,16.24) v1(13.33,22.21) v1(13.54,18.06) v1(14.99,3.67) v1(15.24,22.2) v1(15.24,20.26) v1(15.24,15.99) v1(16.51,35.29) v1(17.02,13.07) v1(17.73,21.59) v1(17.72,16.4) v1(18.16,13.13) v1(19.25,4.18) v1(19.56,20.43) v1(19.56,17.51) v1(19.81,3.8) v1(20.7,36.94) v1(21.42,13.46) v1(21.97,14.21) v1(22.22,15.67) v1(22.56,13.46) v1(23.62,20.69) v1(23.62,19.49) v1(23.62,18.28) v1(23.88,1.76) v1(24.8,20.69) v1(24.8,19.49) v1(24.8,18.29) v1(25.15,12.88) v1(25.94,20.69) v1(26.03,18.28) v1(26.07,19.49) v1(26.35,14.21) v1(26.42,1.76) v1(27.5,16.77) v1(28.96,1.76) v1(30.48,23.36) v1(30.99,16.62) v1(31.55,23.36) v1(31.5,1.76) v1(33.27,16.12) v1(33.53,38.21) v1(33.91,15.48) v1(34.04,1.76) v1(34.42,10.84) v1(34.8,34.66) v1(34.8,33.66) v1(35.31,13.07) v1(36.05,20.28) v1(36.19,10.84) v1(36.58,1.76) v1(37.21,13.19) v1(37.97,10.84) v1(38.56,38.21) v1(38.61,34.12) v1(38.86,13.07) v1(39.12,1.76) v1(39.75,10.84) v1(40.7,27.29) v1(40.84,13.19) v1(41.53,10.84) v1(41.65,1.76) v1(42.1,24.88) v1(42.29,13.19) v1(43.31,10.84) v1(43.94,13.19) v1(44.2,1.76) v1(45.09,23.23) v1(45.09,10.84) v1(45.97,13.19) v1(46.74,1.76) v1(46.87,10.84) v1(47.78,38.98) v1(47.85,37.71) v1(47.85,36.51) v1(47.84,28.88) v1(47.84,27.69) v1(47.84,26.6) v1(47.75,13.19) v1(48.64,10.84) v1(48.95,28.88) v1(48.95,26.6) v1(49.12,37.71) v1(49.12,36.51) v1(49.28,1.76) v1(50.09,28.88) v1(50.07,27.69) v1(50.07,26.6) v1(50.55,12.18) v1(51.82,1.76) v1(52.96,12.81) v1(54.36,1.76) v1(55.81,25.36) v1(55.75,16.24) v1(56.01,14.72) v1(56.93,29.45) v1(56.9,1.76) v1(56.98,30.99) v1(57.02,11.22) v1(58.22,29.46) v1(58.22,25.52) v1(58.29,30.47) v1(58.74,34.02) v1(59.5,1.76) v1(60.07,38.21) v1(61.34,35.74) v1(61.98,1.76) v1(64.01,15.48) v1(65.15,9.89) v1(66.04,38.21) v1(66.04,13.58) v1(67.31,35.74) v1(68.33,7.1) v1(69.47,27.67) v1(69.72,3.33) v1(70.11,31.74) v1(72.01,38.21) v1(73.15,19.04) v1(73.28,35.74) v1(73.28,22.59) v1(73.28,16.5) v1(73.79,26.15) v1(73.79,5.58) v1(74.93,3.16) v1(75.44,23.17) v1(75.44,19.16) v1(75.44,15.99)
VBAT: length 86.6
  Top Layer w0.203: v1(54.41,25.36) 53.78,25.36 53.68,25.46 53.48,25.46 52.25,26.69 U3.33
  Bottom Layer w1.27: v1(54.41,25.36) 54.41,24.44 55.37,23.48 55.37,21.7 49.91,16.24 42.67,16.24 34.04,24.88 12.83,24.88 9.14,21.2 3.68,21.2 ; BAT1.2 3.43,28.77 3.43,11.83 BAT1.1
VBUS: length 66.3
  Top Layer w0.203: v1(55.28,30.98) 55.02,30.73 v1(54.51,30.73) 52.08,28.29 U3.37 ; USBC1.B9 5.55,22.68 4.32,21.45 4.32,19.29 5.42,18.18 USBC1.B4 ; USBC1.A9 5.56,17.88 4.19,19.25 4.19,21.58 5.6,22.98 USBC1.A4
  Bottom Layer w0.203: v1(10.29,26.97) 29.4,26.97 33.78,31.36 v1(54.52,31.36) 54.52,30.73 v1(54.51,30.73)
  vias: v1(8.13,23.48) v1(8.38,24.62) v1(8.51,26.89) v1(8.5,25.78) v1(9.27,25.26) v1(9.27,23.74) v1(9.92,24.62) v1(10.2,25.78) v1(53.93,30.99)
ALDO1: length 23.6
  Top Layer w0.203: U4.13 46.74,8.75 45.97,9.51 45.97,11.92 45.66,12.24 C32.2 45.09,14.6 42.57,17.11 42.57,22.62 44.45,24.5 44.45,25.77 45.38,26.69 U3.18
ALDO2: length 24.8
  Top Layer w0.203: U3.19 45.48,26.29 44.83,25.64 44.83,24.38 42.93,22.47 42.93,17.26 44.93,15.25 46.46,15.25 46.86,14.85 C33.2 47.43,12.24 47.75,11.92 47.75,10.27 49.28,8.75 U4.11
ALDO3: length 26.7
  Top Layer w0.203: U4.15 44.2,8.5 42.42,10.27 42.42,11.8 42.86,12.24 C34.2 43.31,14.21 40.84,16.68 40.84,25.08 41.4,25.64 42.93,25.64 44.78,27.49 U3.16
ALDO4: length 26.4
  Top Layer w0.203: U3.15 44.68,27.89 42.8,26.02 41.28,26.02 40.49,25.23 40.49,16.53 41.53,15.49 C36.2 41.09,12.24 40.64,11.8 40.64,9.77 41.66,8.75 U4.17
BLDO1: length 29.2
  Top Layer w0.203: U3.12 44.22,29.09 43.27,28.14 40.09,28.14 39.74,27.79 39.74,17.51 37.97,15.75 C40.2 37.53,12.24 37.08,11.8 37.08,9.13 36.58,8.62 U4.21
BLDO2: length 26.4
  Top Layer w0.203: U3.14 44.57,28.29 42.66,26.38 41.13,26.38 40.1,25.34 40.1,14.3 39.75,13.96 C42.2 39.31,12.24 38.86,11.8 38.86,8.5 39.12,8.24 U4.19
CHIP_EN: length 80.4
  Top Layer w0.203: v1(27.75,14.21) 27.75,13.12 R1.1 ; v1(66.04,31.74) SW1.2 ; U2.7 26.05,16.27 v1(26.14,16.18)
  Bottom Layer w0.203: v1(26.14,16.18) 26.14,15.5 27.43,14.21 v1(27.75,14.21) 29.21,14.21 29.57,14.57 29.57,14.95 30.46,15.84 32.62,15.84 34.54,13.92 50.8,13.92 53.19,11.52 53.19,5.81 54.34,4.67 63.73,4.67 69.32,10.25 69.32,26.26 66.27,29.3 66.27,31.5 v1(66.04,31.74)
CPUS_LDO: length 33.2
  Top Layer w0.203: U3.10 46.46,30.19 46.12,29.85 43.84,29.85 42.93,28.94 39.76,28.94 39.03,28.21 39.03,17.81 34.42,13.19 C39.1 34.35,12.18 33.91,12.18 31.5,9.77 U4.25
DC1SW: length 24.9
  Top Layer w0.203: U3.20 45.72,25.89 45.19,25.36 45.19,24.23 43.31,22.35 43.31,17.39 45.09,15.61 46.61,15.61 48.64,13.58 C17.1 49.08,12.24 49.53,11.8 49.53,11.04 51.82,8.75 U4.9
DC4SW: length 30.8
  Top Layer w0.203: U4.23 34.04,8.62 35.31,9.89 35.31,11.8 35.75,12.24 C41.1 36.19,14.47 39.39,17.66 39.39,28.07 39.88,28.56 43.05,28.56 43.99,29.49 U3.11
DCDC2: length 10.6
  Top Layer w0.203: U3.26 49.15,23.83 50.54,22.43 51.43,22.43 52.19,21.67 52.19,19.89 51.34,19.05 L9.2 50.6,17.99 50.26,17.64
DCDC3: length 9.6
  Top Layer w0.203: v1(50.41,36.26) v1(51.37,36.26) v1(52.34,36.26) 52.45,36.15 52.45,33.74 51.56,32.85 50.92,32.85 49.55,31.47 U3.4
  vias: v1(50.52,37.71) v1(51.31,37.71) v1(51.92,37.16) v1(61.98,8.33) v1(61.98,7.36) v1(61.98,6.42)
DCDC4: length 11.4
  Top Layer w0.203: U3.9 47.55,31.52 46.1,32.97 44.83,32.97 43.94,33.86 43.94,35.27 44.94,36.26 L11.2 46.45,36.74 C37.1
DCDC5: length 33.4
  Top Layer w0.203: U3.32 52.01,26.29 54.1,24.21 56.26,24.21 56.89,24.85 56.89,27.5 ; 56.89,27.5 57.47,26.92 C18.2 59.3,26.92 59.82,26.4 59.82,9.39 59.44,9 U4.3 ; 56.89,27.5 L12.1 57.42,28.06 C19.2
GPIO0: length 26.4
  Top Layer w0.203: U4.39 13.72,9.26 15.62,11.16 27.2,11.16 29.08,13.04 29.08,14.54 28.64,14.98 25.58,14.98 24.55,16 U2.4
GPIO1: length 24.3
  Top Layer w0.203: U2.5 25.05,16.01 25.72,15.34 28.79,15.34 29.44,14.68 29.44,12.89 27.35,10.81 17.68,10.81 16.26,9.39 U4.37
GPIO2: length 22.2
  Top Layer w0.203: U2.6 25.55,16.01 25.87,15.69 28.93,15.69 29.79,14.83 29.79,12.75 27.5,10.45 19.74,10.45 18.8,9.51 U4.35
GPIO3: length 19
  Top Layer w0.203: U4.33 21.34,9 22.43,10.1 27.65,10.1 30.15,12.6 30.15,14.98 29.08,16.05 26.99,16.05 26.55,16.49 U2.8
GPIO4: length 16.5
  Top Layer w0.203: U4.31 23.88,8.88 24.74,9.74 27.79,9.74 30.51,12.45 30.51,15.12 27.89,17.74 U2.9
GPIO5: length 15.1
  Top Layer w0.203: U2.10 27.89,18.24 30.86,15.27 30.86,12.31 27.94,9.39 26.92,9.39 26.42,8.88 U4.29
GPIO6: length 36.8
  Top Layer w0.203: U2.12 27.37,19.23 31.43,19.23 31.88,18.78 31.88,16.37 31.5,15.99 v1(31.5,14.93)
  Bottom Layer w0.203: v1(13.72,1.76) 13.72,8.24 15.75,10.27 28.7,10.27 31.5,13.07 v1(31.5,14.93)
GPIO7: length 35.2
  Top Layer w0.203: v1(32.26,14.93) 32.26,18.91 31.43,19.74 U2.13
  Bottom Layer w0.203: v1(32.26,14.93) 32.26,13.33 28.85,9.92 18.31,9.92 16.26,7.86 v1(16.26,1.76)
GPIO12: length 21.6
  Top Layer w0.203: 25.55,22.04 25.55,25.16 27.18,26.78 34.16,26.78 39.88,32.5 CN1.2
GPIO13: length 20.8
  Top Layer w0.203: 25.05,22.04 25.05,25.16 27.03,27.14 34.02,27.14 37.34,30.46 CN1.4
GPIO14: length 28.1
  Top Layer w0.203: 24.55,22.04 24.55,25.17 26.88,27.5 33.87,27.5 36.3,29.92 36.3,35.52 36.96,36.18 39.12,36.18 39.88,36.94 CN1.1
GPIO15: length 26
  Top Layer w0.203: CN1.3 37.34,37.07 35.94,35.67 35.94,30.07 33.72,27.85 26.74,27.85 24.05,25.17 24.05,22.04
GPIO16: length 23.4
  Top Layer w0.203: 23.55,22.04 23.55,25.17 26.59,28.21 30.63,28.21 33.78,31.36 33.78,35.67 34.8,36.69 CN1.5
GPIO17: length 23.6
  Top Layer w0.203: CN1.7 32.26,36.69 33.43,35.52 33.43,31.51 30.48,28.56 26.44,28.56 23.05,25.17 23.05,22.04
IRQ: length 80.7
  Top Layer w0.203: R4.2 74.75,34.34 C24.2 71.88,32.94 71.88,30.59 70.6,29.31 60.21,29.31 59.31,30.21 59.31,31.1 v1(58.93,31.48) 58.29,32.12 53.7,32.12 52.68,31.1 52.68,29.43 52.46,29.21 52.46,29.2 51.95,28.69 U3.38 ; v1(31.75,21.83) 31.16,21.24 U2.16
  Bottom Layer w0.203: v1(58.93,31.48) 58.93,23.23 50.88,15.18 36.5,15.18 35.18,16.5 35.18,21.96 34.8,22.34 32.26,22.34 v1(31.75,21.83)
PWROK: length 33.3
  Top Layer w0.203: R5.2 68.78,34.34 C25.2 66.61,35.04 57.86,35.04 v1(56.84,34.02) ; U3.29 50.35,24.7 50.93,24.12 52.19,24.12 53.68,22.63 56.23,22.63 v1(56.64,22.21)
  Bottom Layer w0.203: v1(56.84,34.02) 56.84,33.45 57.66,32.63 57.66,22.97 56.9,22.21 v1(56.64,22.21)
PWRON: length 43
  Top Layer w0.203: v1(62.87,34.28) R6.2 62.81,34.34 C27.2 ; v1(51.18,24.75) 50.75,25.19 U3.30
  Bottom Layer w0.203: v1(51.18,24.75) 51.69,24.75 52.2,25.26 52.2,26.28 51.82,26.66 51.82,27.42 52.45,28.05 55.63,28.05 56.36,28.79 56.36,32.14 55.37,33.13 53.85,33.13 53.34,33.64 53.34,34.78 52.83,35.29 50.04,35.29 49.66,35.67 49.66,38.34 50.42,39.1 61.09,39.1 62.87,37.33 v1(62.87,34.28)
RTC_LDO: length 23.8
  Top Layer w0.203: U4.5 56.9,8.88 55.88,9.89 55.88,12.05 56.45,12.62 C43.1 57.02,20.56 55.37,22.21 53.59,22.21 52.04,23.76 50.78,23.76 49.95,24.59 U3.28
SCK: length 61.1
  Top Layer w0.203: v1(60.2,31.99) 60.2,32.37 59.74,32.83 53.41,32.83 51.45,30.87 U3.40 ; v1(32.88,21.26) 32.37,20.74 U2.15
  Bottom Layer w0.203: v1(60.2,31.99) 59.56,31.36 59.56,22.97 51.41,14.82 36.22,14.82 33.53,17.51 33.53,20.23 32.88,20.88 v1(32.88,21.26)
SDA: length 60.1
  Top Layer w0.203: U3.39 51.85,29.09 52.1,29.35 52.1,29.36 52.32,29.58 52.32,31.24 53.55,32.47 58.86,32.47 60.2,31.14 v1(60.2,30.85) ; v1(32.88,19.74) 32.38,20.24 U2.14
  Bottom Layer w0.203: v1(60.2,30.85) 60.2,22.59 52.07,14.47 35.94,14.47 32.89,17.51 32.89,19.73 v1(32.88,19.74)
U0R: length 41
  Top Layer w0.203: U2.27 21.84,20.24 18.48,23.6 12.05,23.6 9.4,20.95 v1(9.4,9.26) ; U4.36 18.8,3.42 17.65,4.56 13.34,4.56 11.31,6.59 v1(11.31,7.35)
  Bottom Layer w0.203: v1(9.4,9.26) 9.4,9.22 11.27,7.35 v1(11.31,7.35)
U0T: length 42.6
  Top Layer w0.203: v1(12.32,7.35) 12.32,6.08 13.49,4.91 19.96,4.91 21.34,3.54 U4.34 ; U2.28 21.83,19.74 18.34,23.24 12.19,23.24 9.78,20.83 9.78,10.53 v1(10.41,9.89)
  Bottom Layer w0.203: v1(10.41,9.89) 12.32,7.99 v1(12.32,7.35)
USB_D+: length 22.2
  Top Layer w0.203: USBC1.A6 5.28,20.68 5.08,20.48 5.08,19.89 5.28,19.68 USBC1.B6 7.63,19.68 11.9,23.95 18.63,23.95 21.84,20.74 U2.26
USB_D-: length 20.7
  Top Layer w0.203: 7.62,21.07 7.62,20.43 7.37,20.18 USBC1.A7 ; 7.62,21.07 7.48,21.21 6.31,21.21 USBC1.B7 ; 7.62,21.07 8.51,21.07 11.75,24.31 18.78,24.31 21.84,21.24 U2.25
VSYS: length 15.9
  Top Layer w0.203: U3.17 45.14,27.09 43.5,25.45 v1(43.5,24.88) ; U3.36 52.44,27.89 54.01,29.46 v1(54.53,29.46) v1(55.4,29.46) ; U3.34 52.57,27.09 v1(52.68,26.99) ; U3.13 44.46,28.69 43.05,27.29 v1(42.1,27.29)
  Top Layer w0.406: v1(53.34,26.37) 53.3,26.37 v1(52.68,26.99)
  vias: v1(47.59,21.15) v1(47.59,20.25) v1(47.85,35.11) v1(47.92,34.31) v1(48.13,21.8) v1(48.51,33.74) v1(48.89,21.16) v1(48.86,20.25) v1(49.12,35.11) v1(49.12,34.31) v1(54.23,33.99) v1(55.37,33.99)
$1N8836: length 4.9
  Top Layer w0.203: L8.1 47.55,22.85 U3.22
$1N8845: length 4.9
  Top Layer w0.203: U3.25 48.75,22.9 L9.1
$1N8850: length 4.8
  Top Layer w0.203: L10.1 49.15,32.49 U3.5
$1N8855: length 4.9
  Top Layer w0.203: L11.1 47.95,32.28 U3.8
$1N8862: length 55.6
  Top Layer w0.203: 28.96,36.88 28.96,33.81 v1(28.03,32.88) ; U3.27 49.55,24.49 50.63,23.41 51.9,23.41 53.33,21.98 v1(53.33,21.41)
  Bottom Layer w0.203: v1(28.03,32.88) 28.41,32.5 55.5,32.5 56.01,31.99 56.01,29.07 55.37,28.44 52.33,28.44 51.35,27.46 51.35,26.19 50.42,25.26 50.42,22.85 51.86,21.41 v1(53.33,21.41)
$1N8871: length 8.3
  Top Layer w0.203: R8.2 53.83,22.98 51.45,25.36 U3.31
$1N8873: length 12
  Top Layer w0.203: LED1.2 53.18,39.7 52.83,39.36 52.83,37.71 53.44,37.1 53.44,33.37 51.84,31.76 51.33,31.76 50.75,31.18 U3.1
$1N8896: length 2.8
  Top Layer w0.203: 54.24,27.51 54.22,27.49 U3.35
$1N8898: length 12.9
  Top Layer w0.203: C28.2 51.06,38.98 53.09,36.95 53.09,33.52 51.69,32.12 51.18,32.12 50.35,31.28 U3.2
$1N13051: length 2.9
  Top Layer w0.203: R5.1 70.11,37.07 SW3.2
$1N13052: length 2.9
  Top Layer w0.203: R6.1 64.14,37.07 SW4.2
$1N13056: length 2.9
  Top Layer w0.203: SW2.2 76.08,37.07 R4.1
$1N13125: length 2.6
  Top Layer w0.203: R9.1 54.23,36.94 53.85,37.33 LED1.1
$1N13254: length 5
  Top Layer w0.203: LED2.2 56.93,39.7 57.78,38.85 Q1.3
$1N13255: length 2.6
  Top Layer w0.203: LED2.1 55.63,37.33 55.37,37.07 R7.1
$1N17315: length 7.9
  Top Layer w0.203: X1.1 15.65,18.47 17.13,18.47 17.72,17.88 C1.1 18.66,18.74 U2.30
$1N17316: length 10
  Top Layer w0.203: U2.29 18.67,19.24 C2.1 16.75,19.23 14.46,19.23 13.54,20.14 X1.3
$1N23040: length 8.8
  Top Layer w0.203: USBC1.A5 8.62,21.68 11.56,24.62 R3.1
$1N23042: length 4.3
  Top Layer w0.203: USBC1.B5 7.59,18.68 8.38,17.89 R2.2
$1N41990: length 27.9
  Top Layer w0.349: U2.1 23.05,15.42 22.61,14.97 21.62,14.97 18.82,12.18 14.61,12.18 9.78,7.35 9.78,4.56 9.27,4.05 6.1,4.05 4.84,2.8 U5.2

## Copper pours and planes (outline as drawn; the poured copper is in the pictures)
3V3 on Top Layer: 26.92,18.88 29.92,18.88 30.33,18.47 30.33,17.58 30.21,17.45 29.19,17.45 28.05,18.6 26.92,18.6
3V3 on Top Layer: 33.78,21.7 34.04,21.96 34.8,21.96 34.93,21.83 34.93,18.15 34.67,17.89 34.04,17.89 33.78,18.15
3V3 on Top Layer: 43.66,22.09 44.42,22.85 45.69,22.85 47.05,24.21 47.05,25.62 47.25,25.62 47.25,23.65 45.81,22.22 44.93,22.22 44.54,21.84 44.54,19.93 44.8,19.68 46.7,19.68 46.83,19.55 46.83,19.54 46.86,19.51 46.86,17.35 46.6,17.1 44.44,17.1 43.66,17.89
3V3 on Top Layer: 26.69,21.73 26.69,22.28 27.01,22.59 28.32,22.59 28.7,22.97 28.7,23.86 28.51,24.05 26.24,24.05 25.91,23.72 25.91,21.73
3V3 on Top Layer: 16.38,14.08 16.51,13.96 19.3,13.96 22.1,16.76 22.1,17.39 22.25,17.54 22.25,17.6 22.56,17.6 22.56,18.38 21.7,18.38 18.54,15.23 16.51,15.23 16.38,15.1
3V3 on Inner2: 26.8,11.92 26.29,11.42 19.82,11.42 18.8,12.44 18.8,13.83 16.38,13.83 16.26,13.96 16.26,15.1 16.38,15.23 18.54,15.23 20.45,17.13 20.45,21.7 22.8,24.05 25.97,24.05 31.83,29.91 31.83,35.29 32.64,35.29 32.64,27.93 29.72,25.01 29.72,20.43 31.12,19.04 33.4,19.04 33.66,19.29 33.66,21.97 35.02,21.97 35.02,19.39 43.08,19.39 43.96,20.27 46.42,20.27 46.67,20.02 46.67,20.01 47.12,19.56 47.12,17.58 46.54,17 29.59,17 27.61,18.99 27.61,21.94 27.19,22.36 23.81,22.36 22.49,21.03 22.49,16.51 20.45,14.47 20.45,13.19 20.88,12.76 22.84,12.76 23.38,13.3 24.38,13.3 24.38,12.36 25.58,12.36 25.78,12.56 25.78,13.45 25.91,13.58 26.67,13.58 26.8,13.45
GND on Top Layer: 49.62,36.06 47.34,36.06 47.34,38.22 49.62,38.22
GND on Top Layer: 0,40.5 77.2,40.5 77.2,0 0,0
GND on Top Layer: 58.77,28.82 56.23,28.82 56.23,31.61 57.88,31.61 58.77,30.73
GND on Top Layer: 31.5,18.53 31.5,16.5 31.24,16.24 30.73,16.24 30.61,16.37 30.61,18.53
GND on Top Layer: 9.78,27.93 12,27.93 13.22,29.15 13.22,30.84 12.83,31.23 10.29,31.23 9.78,30.72
GND on Top Layer: 26.42,25.26 30.35,25.26 32.13,23.48 32.13,22.59 32,22.47 30.48,22.47 28.57,24.37 26.42,24.37
GND on Top Layer: 49.37,17.14 47.09,17.14 47.09,19.3 49.37,19.3
GND on Top Layer: 21.78,18.58 18.61,15.4 12.38,15.4 10.22,17.56 10.22,20.75 12.36,22.89 18.35,22.89 21.78,19.47 18.86,19.47 18.48,19.85 18.48,20.61 18.22,20.86 16.95,20.86 16.95,19.97 16.45,19.47 14.67,19.47 14.42,19.72 14.42,21.37 12.51,21.37 12.51,18.93 14.19,18.93 14.29,18.83 14.29,17.51 15,16.8 15.94,16.8 16.32,17.18 18.35,17.18 18.48,17.31 18.48,18.07 18.99,18.58
GND on Bottom Layer: 0,40.5 77.2,40.5 77.2,0 0,0
GND on Inner1: 0,40.5 77.2,40.5 77.2,0 0,0
GND on Inner2: 22.73,20.94 23.16,21.37 26.5,21.37 26.8,21.07 26.8,17.89 26.42,17.51 23.11,17.51 22.73,17.89
GND on Inner2: 50.92,29.67 50.92,25.74 47.06,25.74 47.06,29.67
GND on Inner2: 0,40.5 77.2,40.5 77.2,0 0,0
VBAT on Top Layer: 54.92,24.63 54.07,24.63 52.11,26.59 51.02,26.59 51.02,26.79 52.29,26.79 53.05,26.03 54.92,26.03
VBAT on Top Layer: 2.16,33.01 3.84,33.01 4.38,32.46 4.38,29.39 3.17,28.18 1.14,28.18 0.64,28.69 0.64,31.48
VBAT on Top Layer: 1.02,12.43 3.3,12.43 4.32,11.42 4.32,8.37 4.06,8.11 1.91,8.11 0.64,9.39 0.64,12.05
VBAT on Bottom Layer: 3.68,22.72 4.95,21.45 4.95,20.91 3.43,19.39 3.43,22.47
VBUS on Top Layer: 5.63,23.13 7.14,23.13 7.49,23.48 7.49,27.33 7.75,27.58 10.76,27.58 10.92,27.42 10.92,24.5 8.76,22.34 7.37,22.34 7.17,22.53 5.63,22.53
VBUS on Top Layer: 51.02,28.19 52.17,28.19 54.32,30.34 55.82,30.34 55.82,31.5 55.58,31.75 53.82,31.75 53.05,30.98 53.05,29.46 51.99,28.39 51.02,28.39
VBUS on Bottom Layer: 55.72,30.44 55.72,31.62 55.46,31.87 33.54,31.87 31.37,29.7 9.19,29.7 7.16,27.67 7.16,23.56 7.87,22.85 9.14,22.85 12.19,25.89 32.26,25.89 36.58,30.21 55.5,30.21
DCDC2 on Top Layer: 54.99,6.46 54.48,5.96 53.72,5.96 53.72,13.16 49.62,17.25 49.62,19.55 49.75,19.68 51.53,19.68 51.78,19.93 51.78,21.71 51.28,22.22 50.39,22.22 49.05,23.56 49.05,25.49 49.25,25.49 49.25,24.25 50.39,23.11 51.78,23.11 52.8,22.09 52.8,17.16 54.99,14.97
DCDC3 on Top Layer: 49.88,38.09 50.01,38.22 51.35,38.22 52.8,36.77 52.8,33.65 51.66,32.5 51.02,32.5 49.65,31.13 49.65,29.89 49.45,29.89 49.45,31.69 50.9,33.14 51.53,33.14 52.04,33.65 52.04,35.42 51.78,35.68 50.01,35.68 49.88,35.81
DCDC3 on Bottom Layer: 50.04,38.21 50.04,35.73 50.1,35.67 57.78,35.67 61.21,32.25 61.21,5.83 62.74,5.83 62.74,33.64 58.17,38.21
DCDC4 on Top Layer: 28.32,5.96 28.32,9.26 36.7,17.64 36.7,29.13 39.06,31.48 40.77,31.48 42.67,33.39 42.67,35.93 44.99,38.24 46.97,38.24 47.17,38.04 47.17,35.76 46.95,35.55 45.21,35.55 44.67,35 44.67,33.66 45.2,33.13 46.23,33.13 47.65,31.72 47.65,29.89 47.45,29.89 47.45,30.59 47.16,30.85 46.23,30.85 45.59,30.21 43.56,30.21 42.67,29.32 39.62,29.32 38.61,28.31 38.61,17.89 29.59,8.88 29.59,5.96
DCDC5 on Top Layer: 51.86,26.19 51.15,26.19 51.15,26.39 52.04,26.39 53.97,24.47 56.14,24.47 56.51,24.83 56.51,25.99 56.1,26.4 56.1,28.57 57.06,28.57 57.15,28.66 58.67,28.66 58.76,28.57 58.77,28.57 58.77,28.56 58.8,28.53 58.8,26.28 58.74,26.22 57.71,26.22 57.53,26.04 57.53,23.96 56.89,23.32 53.97,23.32 52.19,25.1 52.19,25.86
DCDC5 on Top Layer: 58.8,5.96 60.07,5.96 60.07,19.67 61.34,20.94 61.34,27.04 59.82,28.56 56.26,28.56 56.26,27.55 57.28,26.53 58.4,26.53 59.31,25.62 59.31,21.96 58.8,21.45
VSYS on Top Layer: 51.15,27.19 51.15,26.99 52.33,26.99 53.21,26.12 53.59,26.12 53.72,26.24 53.72,26.37 52.89,27.19
VSYS on Top Layer: 47.34,35.67 49.51,35.67 49.62,35.55 49.62,34.03 48.85,33.25 48.85,29.77 48.25,29.77 48.25,33.25 47.34,34.16
VSYS on Top Layer: 55.85,29.96 54.2,29.96 52.23,27.99 51.02,27.99 51.02,27.79 52.59,27.79 53.74,28.95 55.85,28.95
VSYS on Top Layer: 49.37,19.8 47.09,19.8 47.09,21.58 47.85,22.34 47.85,25.65 48.45,25.65 48.45,22.33 49.37,21.41
VSYS on Inner2: 49.34,20.05 48.84,19.55 47.59,19.55 46.99,20.15 46.99,22.31 45.15,24.14 43.31,24.14 42.93,24.52 42.93,25.39 41.66,26.66 41.66,26.95 41.64,26.96 41.64,27.78 41.78,27.93 44.24,27.93 47.93,24.23 51.45,24.23 51.68,24.47 51.68,32.72 50.95,33.46 49.37,33.46 49.02,33.1 48.25,33.1 47.17,34.19 47.17,35.44 47.53,35.81 49.38,35.81 49.72,35.47 51.35,35.47 52.19,34.63 55.88,34.63 56,34.5 56,33.36 53.94,33.36 53.46,32.88 53.46,30.56 53.97,30.05 55.75,30.05 55.88,29.93 55.88,29.04 55.75,28.91 54.1,28.91 53.84,28.66 53.84,23.23 52.46,21.85 49.59,21.85 49.34,21.6
$1N8836 on Top Layer: 46.7,20.44 44.8,20.44 44.8,21.58 45.18,21.96 46.07,21.96 47.45,23.34 47.45,25.37 47.65,25.37 47.65,22.53 46.7,21.59
$1N8845 on Top Layer: 51.47,20.36 51.66,20.55 51.66,21.58 51.28,21.96 50.26,21.96 48.85,23.41 48.85,25.5 48.65,25.49 48.65,22.56 49.62,21.58 49.62,20.36
$1N8850 on Top Layer: 49.25,29.77 49.25,32 50.62,33.37 51.51,33.37 51.78,33.65 51.78,34.92 50.01,34.92 50.01,33.77 49.05,32.81 49.05,29.77
$1N8855 on Top Layer: 48.05,29.89 47.85,29.89 47.85,32.09 46.42,33.52 45.31,33.52 45.05,33.77 45.05,34.92 46.96,34.92 46.96,33.9 48.05,32.81
$1N8896 on Top Layer: 55.47,26.53 53.82,26.53 52.96,27.39 51.02,27.39 51.02,27.59 52.97,27.59 53.82,28.44 55.47,28.44
$1N17339 on Top Layer: 23.41,17.38 23.41,15.26 23.23,15.07 23.23,13.97 23.37,13.83 25.65,13.83 25.65,14.72 25.4,14.72 24.19,15.93 24.19,17.38

Small or netless copper shapes (teardrops, artwork), in the pictures only: 202 on Top Layer, 31 on Bottom Layer

## Text on the board
Bottom Silkscreen Layer: + | -
Top Silkscreen Layer: GPIO0 | GPIO6 | GPIO1 | GPIO7 | GPIO2 | R0X | GPIO3 | T0X | GPIO4 | GPIO5 | DCDC4 | CPUS / LDO | DLDO2 | BLDO1 | BLDO2 | ALDO4 | ALDO3 | ALDO1 | ALDO2 | DLDO1 | DCDC2 | RTC / LDO | DCDC5 | DCDC3 | shangchi drived by esp32c3 and axp2101 | designed by heiyt
